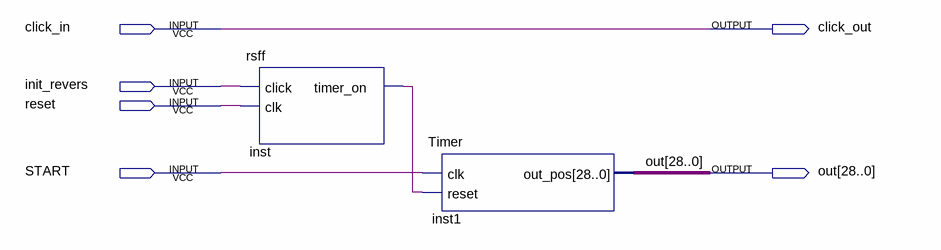
[diagram p0: schematic sheet]
// Quartus schematic inf_counter.bdf as structural Verilog: 2 symbols, 6 pins
module inf_counter (
  input  click_in,
  input  init_revers,
  input  reset,
  input  START,
  output click_out,
  output [28:0] out
);

  wire inst_timer_on;

  rsff inst (.click(init_revers), .clk(reset), .timer_on(inst_timer_on));
  Timer inst1 (.clk(START), .reset(inst_timer_on), .out_pos(out));

  assign click_out = click_in;
endmodule
